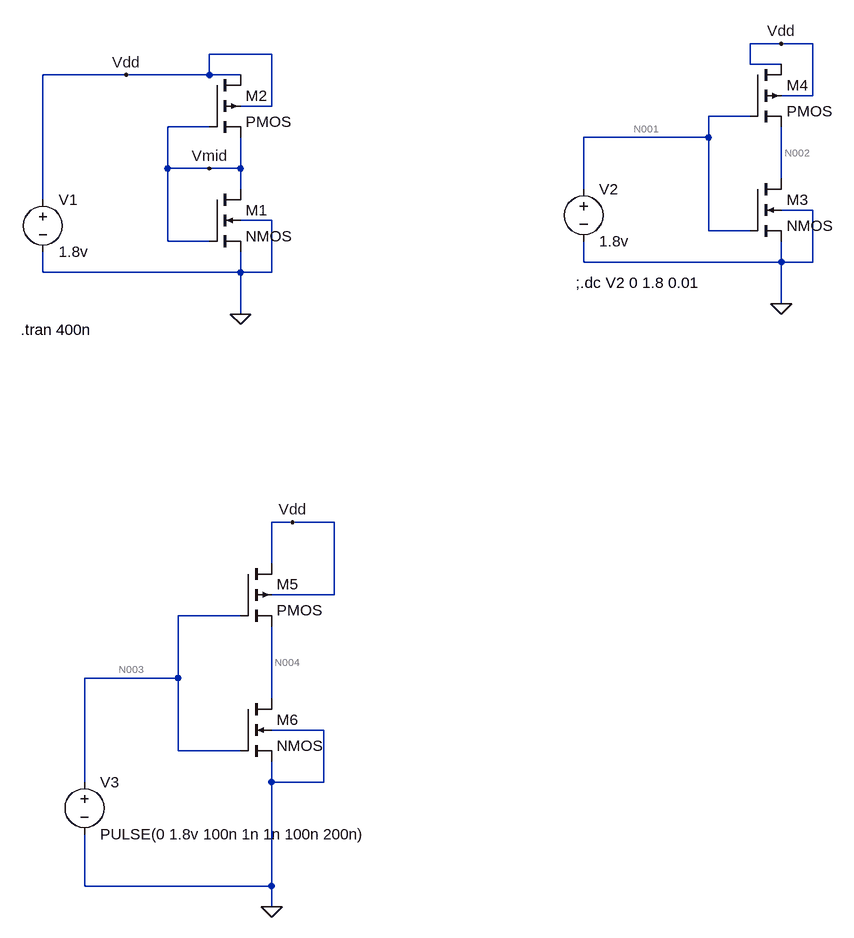
[diagram p0: schematic inverter.asc]
inverter.asc, the LTspice schematic file:
Version 4
SHEET 1 1140 1304
WIRE 1056 -64 1008 -64
WIRE 1104 -64 1056 -64
WIRE 272 -48 176 -48
WIRE 1008 -32 1008 -64
WIRE 1056 -32 1008 -32
WIRE 48 -16 -80 -16
WIRE 176 -16 176 -48
WIRE 176 -16 48 -16
WIRE 224 -16 176 -16
WIRE 1104 16 1104 -64
WIRE 1104 16 1056 16
WIRE 272 32 272 -48
WIRE 272 32 224 32
WIRE 1008 48 944 48
WIRE 176 64 112 64
WIRE 944 80 944 48
WIRE 944 80 752 80
WIRE 112 128 112 64
WIRE 176 128 112 128
WIRE 224 128 224 80
WIRE 224 128 176 128
WIRE 1056 144 1056 64
WIRE 224 160 224 128
WIRE 752 160 752 80
WIRE -80 176 -80 -16
WIRE 1104 192 1056 192
WIRE 272 208 224 208
WIRE 944 224 944 80
WIRE 1008 224 944 224
WIRE 112 240 112 128
WIRE 176 240 112 240
WIRE 752 272 752 240
WIRE 1056 272 1056 240
WIRE 1056 272 752 272
WIRE 1104 272 1104 192
WIRE 1104 272 1056 272
WIRE -80 288 -80 256
WIRE 224 288 224 256
WIRE 224 288 -80 288
WIRE 272 288 272 208
WIRE 272 288 224 288
WIRE 1056 336 1056 272
WIRE 224 352 224 288
WIRE 304 672 272 672
WIRE 368 672 304 672
WIRE 272 736 272 672
WIRE 368 784 368 672
WIRE 368 784 272 784
WIRE 224 816 128 816
WIRE 128 912 128 816
WIRE 128 912 -16 912
WIRE 272 944 272 832
WIRE 352 992 272 992
WIRE 128 1024 128 912
WIRE 224 1024 128 1024
WIRE -16 1072 -16 912
WIRE 272 1072 272 1040
WIRE 352 1072 352 992
WIRE 352 1072 272 1072
WIRE -16 1232 -16 1152
WIRE 272 1232 272 1072
WIRE 272 1232 -16 1232
WIRE 272 1264 272 1232
FLAG 224 352 0
FLAG 176 128 Vmid
FLAG 48 -16 Vdd
FLAG 1056 336 0
FLAG 1056 -64 Vdd
FLAG 272 1264 0
FLAG 304 672 Vdd
SYMBOL nmos4 176 160 R0
SYMATTR InstName M1
SYMATTR Value2 l=180n w=180n m=1
SYMBOL pmos4 176 -16 R0
SYMATTR InstName M2
SYMATTR Value2 l=180n w=180n m=1
SYMBOL voltage -80 160 R0
WINDOW 123 0 0 Left 0
WINDOW 39 0 0 Left 0
SYMATTR InstName V1
SYMATTR Value 1.8v
SYMBOL nmos4 1008 144 R0
SYMATTR InstName M3
SYMBOL pmos4 1008 -32 R0
SYMATTR InstName M4
SYMBOL voltage 752 144 R0
WINDOW 123 0 0 Left 0
WINDOW 39 0 0 Left 0
SYMATTR InstName V2
SYMATTR Value 1.8v
SYMBOL pmos4 224 736 R0
SYMATTR InstName M5
SYMBOL nmos4 224 944 R0
SYMATTR InstName M6
SYMBOL voltage -16 1056 R0
WINDOW 123 0 0 Left 0
WINDOW 39 0 0 Left 0
SYMATTR InstName V3
SYMATTR Value PULSE(0 1.8v 100n 1n 1n 100n 200n)
TEXT -114 376 Left 2 !.tran 400n
TEXT 740 304 Left 2 !;.dc V2 0 1.8 0.01

The netlist it stands for:
* inverter.asc
M1 Vmid Vmid 0 0 NMOS l=180n w=180n m=1
M2 Vdd Vmid Vmid Vdd PMOS l=180n w=180n m=1
V1 Vdd 0 1.8v
M3 N002 N001 0 0 NMOS
M4 Vdd N001 N002 Vdd PMOS
V2 N001 0 1.8v
M5 Vdd N003 N004 Vdd PMOS
M6 N004 N003 0 0 NMOS
V3 N003 0 PULSE(0 1.8v 100n 1n 1n 100n 200n)
.model NMOS NMOS
.model PMOS PMOS
.lib standard.mos
.tran 400n
;.dc V2 0 1.8 0.01
.backanno
.end

* Results of the author's LTspice run, read from the files saved beside the schematic
* Operating Point, zero values left out:
*   V(vmid) = 900 mV
*   V(vdd) = 1.8 V
*   V(n002) = 100.3 nV
*   V(n001) = 1.8 V
*   V(n004) = 1.8 V
*   Id(M5) = 3.61 pA
*   Is(M5) = -3.61 pA
*   Id(M4) = 1.8 pA
*   Ib(M4) = 1.81 pA
*   Is(M4) = -3.61 pA
*   Id(M2) = 8.1 µA
*   Is(M2) = -8.1 µA
*   Id(M6) = 3.61 pA
*   Ib(M6) = -1.81 pA
*   Is(M6) = -1.8 pA
*   Id(M3) = 3.61 pA
*   Is(M3) = -3.61 pA
*   Id(M1) = 8.1 µA
*   Is(M1) = -8.1 µA
*   I(V1) = -8.1 µA
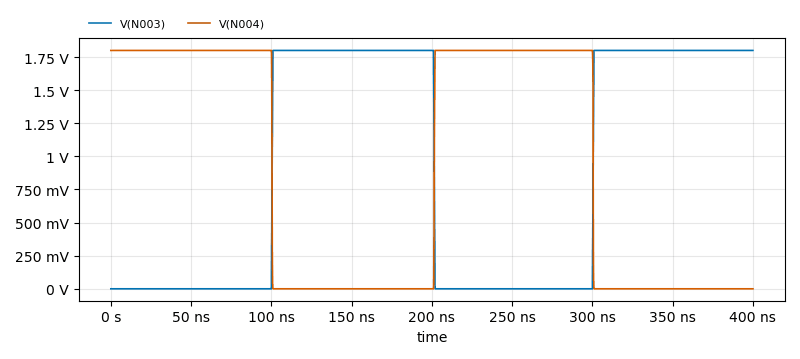
[diagram p1: Transient Analysis of inverter.asc, plotted from the saved traces]
* Transient Analysis, 1 run:
*   V(N003): min 0 V, max 1.8 V, average 902.2 mV, rms 1.273 V, last 1.8 V
*   V(N004): min 0 V, max 1.801 V, average 897.4 mV, rms 1.27 V, last 0 V